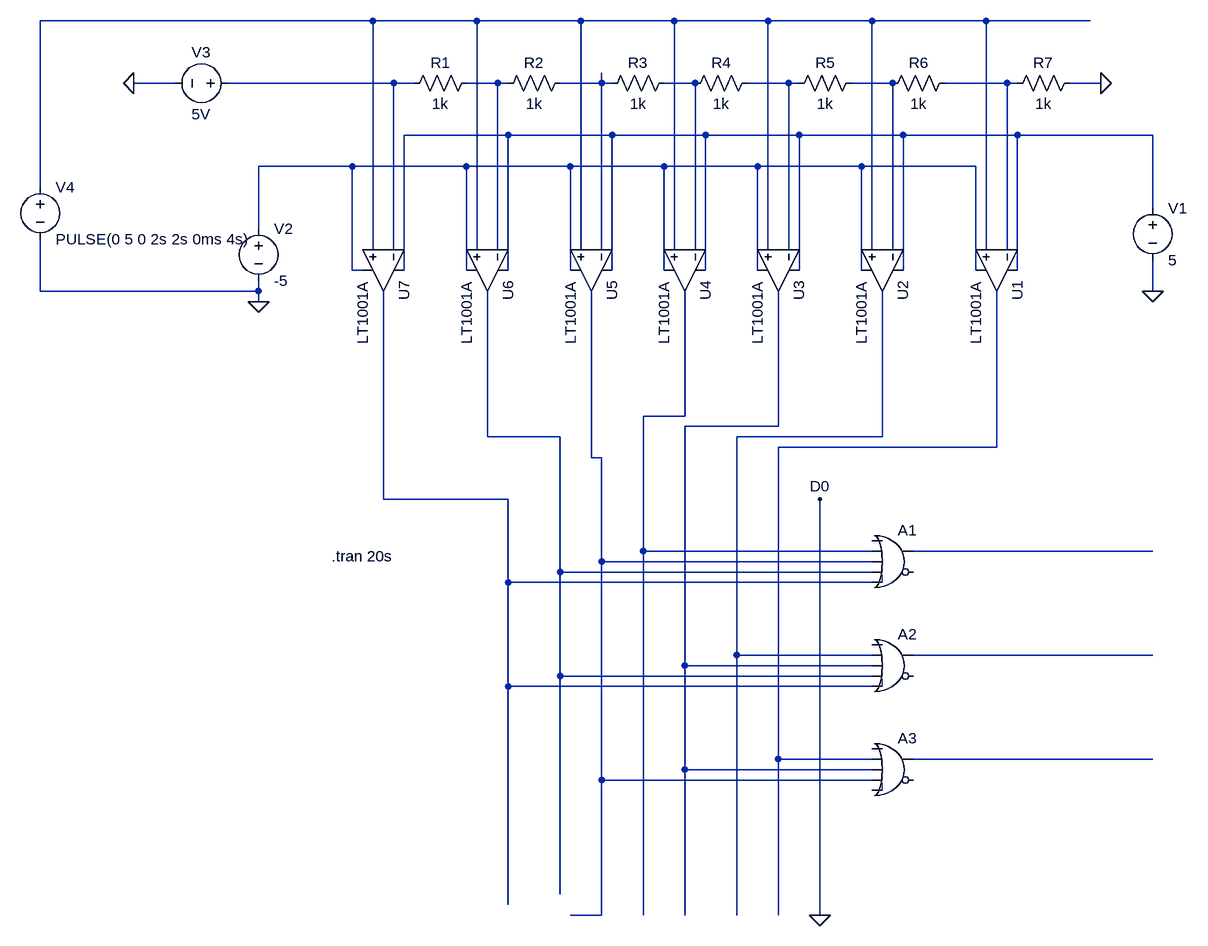
[diagram p0: schematic Design_ADC.asc]
Design_ADC.asc, the LTspice schematic file:
Version 4
SHEET 1 1004 784
WIRE -256 -608 -768 -608
WIRE -96 -608 -256 -608
WIRE 64 -608 -96 -608
WIRE 208 -608 64 -608
WIRE 352 -608 208 -608
WIRE 512 -608 352 -608
WIRE 688 -608 512 -608
WIRE 848 -608 688 -608
WIRE -560 -512 -624 -512
WIRE -224 -512 -480 -512
WIRE -192 -512 -224 -512
WIRE -64 -512 -112 -512
WIRE -48 -512 -64 -512
WIRE 96 -512 96 -528
WIRE 96 -512 32 -512
WIRE 112 -512 96 -512
WIRE 240 -512 192 -512
WIRE 384 -512 320 -512
WIRE 400 -512 384 -512
WIRE 544 -512 480 -512
WIRE 720 -512 624 -512
WIRE 736 -512 720 -512
WIRE 864 -512 816 -512
WIRE -48 -432 -208 -432
WIRE 112 -432 -48 -432
WIRE 256 -432 112 -432
WIRE 400 -432 256 -432
WIRE 560 -432 400 -432
WIRE 736 -432 560 -432
WIRE 944 -432 736 -432
WIRE -288 -384 -432 -384
WIRE -112 -384 -288 -384
WIRE 48 -384 -112 -384
WIRE 192 -384 48 -384
WIRE 336 -384 192 -384
WIRE 496 -384 336 -384
WIRE 672 -384 496 -384
WIRE -768 -352 -768 -608
WIRE 944 -320 944 -432
WIRE -432 -288 -432 -384
WIRE -256 -256 -256 -608
WIRE -224 -256 -224 -512
WIRE -96 -256 -96 -608
WIRE -64 -256 -64 -512
WIRE 64 -256 64 -608
WIRE 96 -256 96 -512
WIRE 208 -256 208 -608
WIRE 240 -256 240 -512
WIRE 352 -256 352 -608
WIRE 384 -256 384 -512
WIRE 512 -256 512 -608
WIRE 544 -256 544 -512
WIRE 688 -256 688 -608
WIRE 720 -256 720 -512
WIRE -288 -224 -288 -384
WIRE -272 -224 -288 -224
WIRE -208 -224 -208 -432
WIRE -112 -224 -112 -384
WIRE -48 -224 -48 -432
WIRE 48 -224 48 -384
WIRE 112 -224 112 -432
WIRE 192 -224 192 -384
WIRE 256 -224 256 -432
WIRE 336 -224 336 -384
WIRE 400 -224 400 -432
WIRE 496 -224 496 -384
WIRE 560 -224 560 -432
WIRE 672 -224 672 -384
WIRE 736 -224 736 -432
WIRE -768 -192 -768 -272
WIRE -432 -192 -432 -208
WIRE -432 -192 -768 -192
WIRE 944 -192 944 -240
WIRE -432 -176 -432 -192
WIRE 224 0 224 -192
WIRE 224 0 160 0
WIRE 368 16 368 -192
WIRE 368 16 224 16
WIRE -80 32 -80 -192
WIRE 32 32 -80 32
WIRE 528 32 528 -192
WIRE 528 32 304 32
WIRE 704 48 704 -192
WIRE 704 48 368 48
WIRE 80 64 80 -192
WIRE 96 64 80 64
WIRE -240 128 -240 -192
WIRE -48 128 -240 128
WIRE 160 208 160 0
WIRE 512 208 160 208
WIRE 944 208 576 208
WIRE 96 224 96 64
WIRE 512 224 96 224
WIRE 32 240 32 32
WIRE 512 240 32 240
WIRE -48 256 -48 128
WIRE 512 256 -48 256
WIRE 304 368 304 32
WIRE 512 368 304 368
WIRE 944 368 576 368
WIRE 224 384 224 16
WIRE 512 384 224 384
WIRE 32 400 32 240
WIRE 512 400 32 400
WIRE -48 416 -48 256
WIRE 512 416 -48 416
WIRE 368 528 368 48
WIRE 512 528 368 528
WIRE 944 528 576 528
WIRE 224 544 224 384
WIRE 512 544 224 544
WIRE 96 560 96 224
WIRE 512 560 96 560
WIRE 32 736 32 400
WIRE -48 752 -48 416
WIRE 96 768 96 560
WIRE 96 768 48 768
WIRE 160 768 160 208
WIRE 224 768 224 544
WIRE 304 768 304 368
WIRE 368 768 368 528
WIRE 432 768 432 128
FLAG 432 128 D0
FLAG 432 768 0
FLAG 864 -512 0
FLAG -624 -512 0
FLAG -432 -176 0
FLAG 944 -192 0
SYMBOL Digital/or 544 160 R0
SYMATTR InstName A1
SYMBOL Digital/or 544 320 R0
SYMATTR InstName A2
SYMBOL Digital/or 544 480 R0
SYMATTR InstName A3
SYMBOL OpAmps/LT1001A 768 -224 R90
SYMATTR InstName U1
SYMBOL OpAmps/LT1001A 592 -224 R90
SYMATTR InstName U2
SYMBOL OpAmps/LT1001A 432 -224 R90
SYMATTR InstName U3
SYMBOL OpAmps/LT1001A 288 -224 R90
SYMATTR InstName U4
SYMBOL OpAmps/LT1001A 144 -224 R90
SYMATTR InstName U5
SYMBOL OpAmps/LT1001A -16 -224 R90
SYMATTR InstName U6
SYMBOL OpAmps/LT1001A -176 -224 R90
SYMATTR InstName U7
SYMBOL res -96 -528 R90
WINDOW 0 0 56 VBottom 2
WINDOW 3 32 56 VTop 2
SYMATTR InstName R1
SYMATTR Value 1k
SYMBOL res 48 -528 R90
WINDOW 0 0 56 VBottom 2
WINDOW 3 32 56 VTop 2
SYMATTR InstName R2
SYMATTR Value 1k
SYMBOL res 208 -528 R90
WINDOW 0 0 56 VBottom 2
WINDOW 3 32 56 VTop 2
SYMATTR InstName R3
SYMATTR Value 1k
SYMBOL res 336 -528 R90
WINDOW 0 0 56 VBottom 2
WINDOW 3 32 56 VTop 2
SYMATTR InstName R4
SYMATTR Value 1k
SYMBOL res 496 -528 R90
WINDOW 0 0 56 VBottom 2
WINDOW 3 32 56 VTop 2
SYMATTR InstName R5
SYMATTR Value 1k
SYMBOL res 640 -528 R90
WINDOW 0 0 56 VBottom 2
WINDOW 3 32 56 VTop 2
SYMATTR InstName R6
SYMATTR Value 1k
SYMBOL res 832 -528 R90
WINDOW 0 0 56 VBottom 2
WINDOW 3 32 56 VTop 2
SYMATTR InstName R7
SYMATTR Value 1k
SYMBOL voltage 944 -336 R0
SYMATTR InstName V1
SYMATTR Value 5
SYMBOL voltage -432 -304 R0
SYMATTR InstName V2
SYMATTR Value -5
SYMBOL voltage -464 -512 R90
WINDOW 0 -32 56 VBottom 2
WINDOW 3 32 56 VTop 2
SYMATTR InstName V3
SYMATTR Value 5V
SYMBOL voltage -768 -368 R0
SYMATTR InstName V4
SYMATTR Value PULSE(0 5 0 2s 2s 0ms 4s)
TEXT -320 216 Left 2 !.tran 20s

The netlist it stands for:
* Design_ADC.asc
A1 0 N011 N016 N013 N017 0 N018 0 OR
A2 0 N014 N012 N013 N017 0 N019 0 OR
A3 0 N015 N012 N016 0 0 N020 0 OR
XU1 N001 N008 N009 N010 N015 LT1001  ; LT1001A, pins In+ In- V+ V- OUT
XU2 N001 N007 N009 N010 N014 LT1001  ; LT1001A, pins In+ In- V+ V- OUT
XU3 N001 N006 N009 N010 N012 LT1001  ; LT1001A, pins In+ In- V+ V- OUT
XU4 N001 N005 N009 N010 N011 LT1001  ; LT1001A, pins In+ In- V+ V- OUT
XU5 N001 N004 N009 N010 N016 LT1001  ; LT1001A, pins In+ In- V+ V- OUT
XU6 N001 N003 N009 N010 N013 LT1001  ; LT1001A, pins In+ In- V+ V- OUT
XU7 N001 N002 N009 N010 N017 LT1001  ; LT1001A, pins In+ In- V+ V- OUT
R1 N003 N002 1k
R2 N004 N003 1k
R3 N005 N004 1k
R4 N006 N005 1k
R5 N007 N006 1k
R6 N008 N007 1k
R7 0 N008 1k
V1 N009 0 5
V2 N010 0 -5
V3 N002 0 5V
V4 N001 0 PULSE(0 5 0 2s 2s 0ms 4s)
.tran 20s
.lib LTC.lib
.backanno
.end